# EAGLE design GBAFlex (EAGLE 9.6.2)
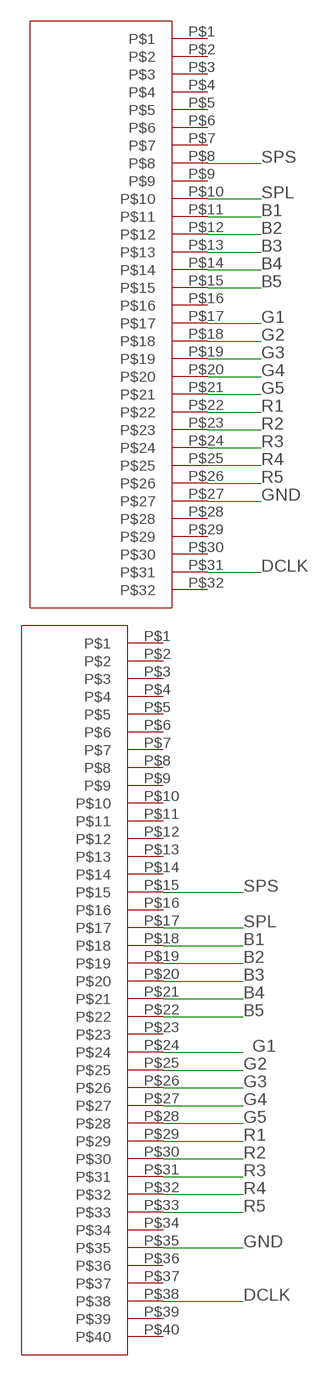
[diagram p0: schematic, sheet 1]

## Parts
U$1  32PIN_0.5MM  [32PIN_0.5MM]
U$2  40PIN_0.5MM  [40PIN_0.5MM]

## Nets
B1: U$1.P$11 U$2.P$18
B2: U$1.P$12 U$2.P$19
B3: U$1.P$13 U$2.P$20
B4: U$1.P$14 U$2.P$21
B5: U$1.P$15 U$2.P$22
DCLK: U$1.P$31 U$2.P$38
G1: U$1.P$17 U$2.P$24
G2: U$1.P$18 U$2.P$25
G3: U$1.P$19 U$2.P$26
G4: U$1.P$20 U$2.P$27
G5: U$1.P$21 U$2.P$28
GND: U$1.P$27 U$2.P$35
R1: U$1.P$22 U$2.P$29
R2: U$1.P$23 U$2.P$30
R3: U$1.P$24 U$2.P$31
R4: U$1.P$25 U$2.P$32
R5: U$1.P$26 U$2.P$33
SPL: U$1.P$10 U$2.P$17
SPS: U$1.P$8 U$2.P$15
Unconnected: U$1.P$1 U$1.P$2 U$1.P$3 U$1.P$4 U$1.P$5 U$1.P$6 U$1.P$7 U$1.P$9 U$1.P$16 U$1.P$28 U$1.P$29 U$1.P$30 U$1.P$32 U$2.P$1 U$2.P$2 U$2.P$3 U$2.P$4 U$2.P$5 U$2.P$6 U$2.P$7 U$2.P$8 U$2.P$9 U$2.P$10 U$2.P$11 U$2.P$12 U$2.P$13 U$2.P$14 U$2.P$16 U$2.P$23 U$2.P$34 U$2.P$36 U$2.P$37 U$2.P$39 U$2.P$40

## Library data of the parts
U$1 = 32pin_0.5mm:32PIN_0.5MM
U$2 = 40pin_0.5mm:40PIN_0.5MM

## Board
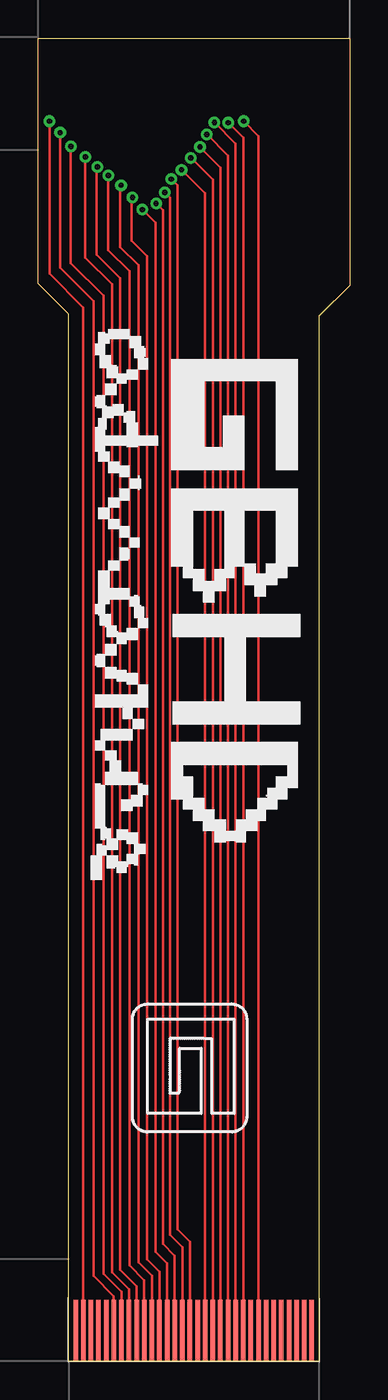
[diagram p1: board, top side]
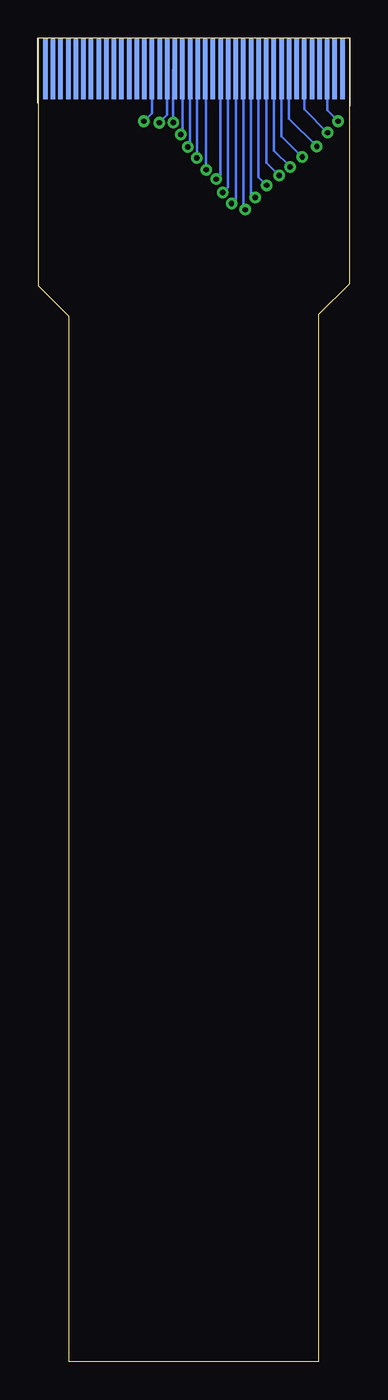
[diagram p2: board, bottom side, seen from below]

Size 20.45 x 86.8 mm. Coordinates in mm from the lower left corner, seen from the top.
Outline: 2,0 2,68.7 0,70.7 0,86.8 20.45,86.8 20.45,70.55 18.45,68.55 18.45,0 2,0
Copper layers (1*16): Top 0.035mm / dielectric 1.5mm / Bottom 0.035mm
Design rules "default": minimum track width 6mil, minimum drill 0.35mm, track to track 6mil, track to pad 6mil, pad to pad 6mil, via to via 6mil, smd to smd 6mil, copper to edge 40mil, drill to drill 6mil, minimum pad ring 10mil, minimum via ring 8mil, stop-mask expansion 4mil, vias tented up to drill 0mil, thermal gap 10mil

### Footprints (pad centres in the part's own frame; a part is rotated, then mirrored left to right if it is on the bottom)
32PIN_0.5MM = smd 0.3 x 4: P$1 0.15,0; P$2 0.65,0; P$3 1.15,0; P$4 1.65,0; P$5 2.15,0; P$6 2.65,0; P$7 3.15,0; P$8 3.65,0; P$9 4.15,0; P$10 4.65,0; P$11 5.15,0; P$12 5.65,0; P$13 6.15,0; P$14 6.65,0; P$15 7.15,0; P$16 7.65,0; P$17 8.15,0; P$18 8.65,0; P$19 9.15,0; P$20 9.65,0; P$21 10.15,0; P$22 10.65,0; P$23 11.15,0; P$24 11.65,0; P$25 12.15,0; P$26 12.65,0; P$27 13.15,0; P$28 13.65,0; P$29 14.15,0; P$30 14.65,0; P$31 15.15,0; P$32 15.65,0
40PIN_0.5MM = smd 0.3 x 4: P$1 0.15,0; P$2 0.65,0; P$3 1.15,0; P$4 1.65,0; P$5 2.15,0; P$6 2.65,0; P$7 3.15,0; P$8 3.65,0; P$9 4.15,0; P$10 4.65,0; P$11 5.15,0; P$12 5.65,0; P$13 6.15,0; P$14 6.65,0; P$15 7.15,0; P$16 7.65,0; P$17 8.15,0; P$18 8.65,0; P$19 9.15,0; P$20 9.65,0; P$21 10.15,0; P$22 10.65,0; P$23 11.15,0; P$24 11.65,0; P$25 12.15,0; P$26 12.65,0; P$27 13.15,0; P$28 13.65,0; P$29 14.15,0; P$30 14.65,0; P$31 15.15,0; P$32 15.65,0; P$33 16.15,0; P$34 16.65,0; P$35 17.15,0; P$36 17.65,0; P$37 18.15,0; P$38 18.65,0; P$39 19.15,0; P$40 19.65,0

### Placement (x,y rotation side)
U$1  18.12,2.04 180 top
U$2  20.12,84.79 0 bottom
U$3  [GAMEBOXCARTBOY]  7.2,22.45 270 top
U$4  [GBHDADV#PNG]  10.3,49.55 270 top

### Tracks (layer width: path | path; a pad name or v marks a point on that pad's centre or on a via)
B1  (via drill 0.35)
  Top 0.152: U$1.P$11 12.97,79.88 v11.58,81.28
  Bottom 0.152: v11.58,81.28 11.58,84.68 U$2.P$18
B2  (via drill 0.35)
  Top 0.152: U$1.P$12 12.47,79.1 v11.08,80.49
  Bottom 0.152: v11.08,80.49 10.97,80.6 U$2.P$19
B3  (via drill 0.35)
  Top 0.152: U$1.P$13 11.97,78.31 v10.63,79.65
  Bottom 0.152: v10.63,79.65 10.47,79.81 U$2.P$20
B4  (via drill 0.35)
  Top 0.152: U$1.P$14 11.47,77.5 v10.02,78.95
  Bottom 0.152: v10.02,78.95 10.02,84.74 U$2.P$21
B5  (via drill 0.35)
  Top 0.152: U$1.P$15 10.97,76.61 v9.42,78.17
  Bottom 0.152: v9.42,78.17 9.42,84.74 U$2.P$22
DCLK  (via drill 0.35)
  Top 0.152: U$1.P$31 2.97,69.13 0.75,71.35 v0.75,81.35
  Bottom 0.152: v0.75,81.35 1.47,82.07 U$2.P$38
G1  (via drill 0.35)
  Top 0.152: U$1.P$17 9.97,7.83 9.15,8.65 9.15,77.15 v8.75,77.55
  Bottom 0.152: v8.75,77.55 8.47,77.83 U$2.P$24
G2  (via drill 0.35)
  Top 0.152: U$1.P$18 9.47,7.48 8.65,8.3 8.65,76.33 v8.32,76.67
  Bottom 0.152: v8.32,76.67 7.97,77.02 U$2.P$25
G3  (via drill 0.35)
  Top 0.152: U$1.P$19 8.97,6.93 8.2,7.7 8.2,75.5 v7.75,75.95
  Bottom 0.152: v7.75,75.95 7.47,76.23 U$2.P$26
G4  (via drill 0.35)
  Top 0.152: U$1.P$20 8.47,6.43 7.7,7.2 7.7,74.7 v6.85,75.55
  Bottom 0.152: v6.85,75.55 6.97,75.67 U$2.P$27
G5  (via drill 0.35)
  Top 0.152: U$1.P$21 7.97,5.88 7.15,6.7 7.15,72.5 6.15,73.5 6.15,76.3 v6.2,76.35
  Bottom 0.152: v6.2,76.35 6.47,76.62 U$2.P$28
GND  (via drill 0.35)
  Top 0.152: U$1.P$27 4.97,4.28 3.65,5.6 3.65,69.55 1.45,71.75 v1.45,80.6
  Bottom 0.152: v1.45,80.6 2.97,82.12 U$2.P$35
R1  (via drill 0.35)
  Top 0.152: U$1.P$22 7.47,5.63 6.6,6.5 6.6,71.9 5.4,73.1 5.4,77.1 v5.45,77.15
  Bottom 0.152: v5.45,77.15 5.97,77.67 U$2.P$29
R2  (via drill 0.35)
  Top 0.152: U$1.P$23 6.97,5.33 6,6.3 6,71.5 4.6,72.9 4.6,77.77 v4.62,77.78
  Bottom 0.152: v4.62,77.78 5.47,78.64 U$2.P$30
R3  (via drill 0.35)
  Top 0.152: U$1.P$24 6.47,4.93 5.4,6 5.4,71.05 3.85,72.6 3.85,78.3 v3.9,78.35
  Bottom 0.152: v3.9,78.35 4.97,79.42 U$2.P$31
R4  (via drill 0.35)
  Top 0.152: U$1.P$25 5.97,4.73 4.85,5.85 4.85,70.65 3.1,72.4 v3.1,79
  Bottom 0.152: v3.1,79 4.47,80.37 U$2.P$32
R5  (via drill 0.35)
  Top 0.152: U$1.P$26 5.47,4.58 4.3,5.75 4.3,69.9 2.15,72.05 v2.15,79.7
  Bottom 0.152: v2.15,79.7 3.97,81.52 U$2.P$33
SPL  (via drill 0.35)
  Top 0.152: U$1.P$10 13.47,80.27 v12.49,81.25
  Bottom 0.152: v12.49,81.25 11.97,81.77 U$2.P$17
SPS  (via drill 0.35)
  Top 0.152: U$1.P$8 14.47,80.38 v13.5,81.35
  Bottom 0.152: v13.5,81.35 12.97,81.88 U$2.P$15

### Text on the board
tDocu: Top Stiffener | Bottom Stiffener